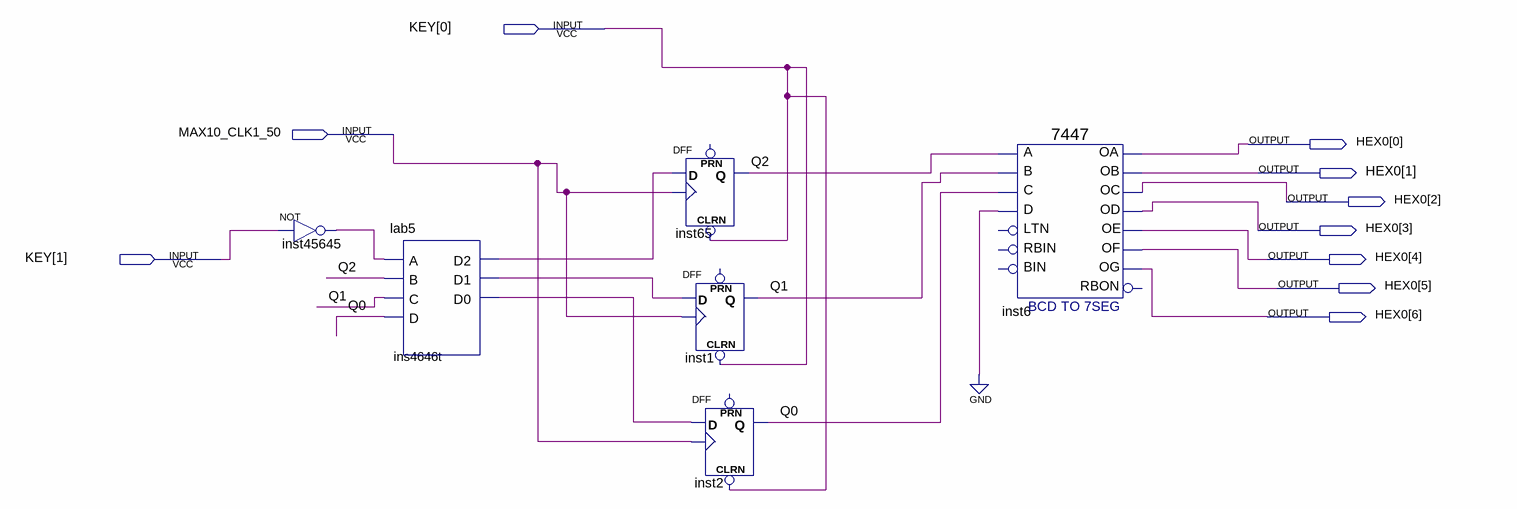
[diagram p0: schematic sheet]
// Quartus schematic Block4.bdf as structural Verilog: 6 symbols, 10 pins
module Block4 (
  input  [1:0] KEY,
  input  MAX10_CLK1_50,
  output [6:0] HEX0
);

  wire ins4646t_d0, ins4646t_d1, ins4646t_d2, inst45645_out, Q0, Q1, Q2;

  not inst45645 (inst45645_out, KEY[1]);
  lab5 ins4646t (.A(inst45645_out), .B(Q2), .C(Q1), .D(Q0), .D2(ins4646t_d2), .D1(ins4646t_d1), .D0(ins4646t_d0));
  DFF inst65 (.CLRN(KEY[0]), .CLK(MAX10_CLK1_50), .D(ins4646t_d2), .Q(Q2));  // open: PRN
  DFF inst1 (.CLRN(KEY[0]), .CLK(MAX10_CLK1_50), .D(ins4646t_d1), .Q(Q1));  // open: PRN
  DFF inst2 (.CLRN(KEY[0]), .CLK(MAX10_CLK1_50), .D(ins4646t_d0), .Q(Q0));  // open: PRN
  \7447  inst6 (
    .B(Q1), .C(Q0), .D(1'b0), .A(Q2), .OB(HEX0[1]), .OC(HEX0[2]), .OE(HEX0[4]), .OD(HEX0[3]), .OF(HEX0[5]),
    .OG(HEX0[6]), .OA(HEX0[0]));  // open: LTN, RBIN, BIN, RBON
endmodule
